# Altium schematic sheet Sht5-V12P0_Jetson.SchDoc
size E; SheetNumber: 4; SheetTotal: 5
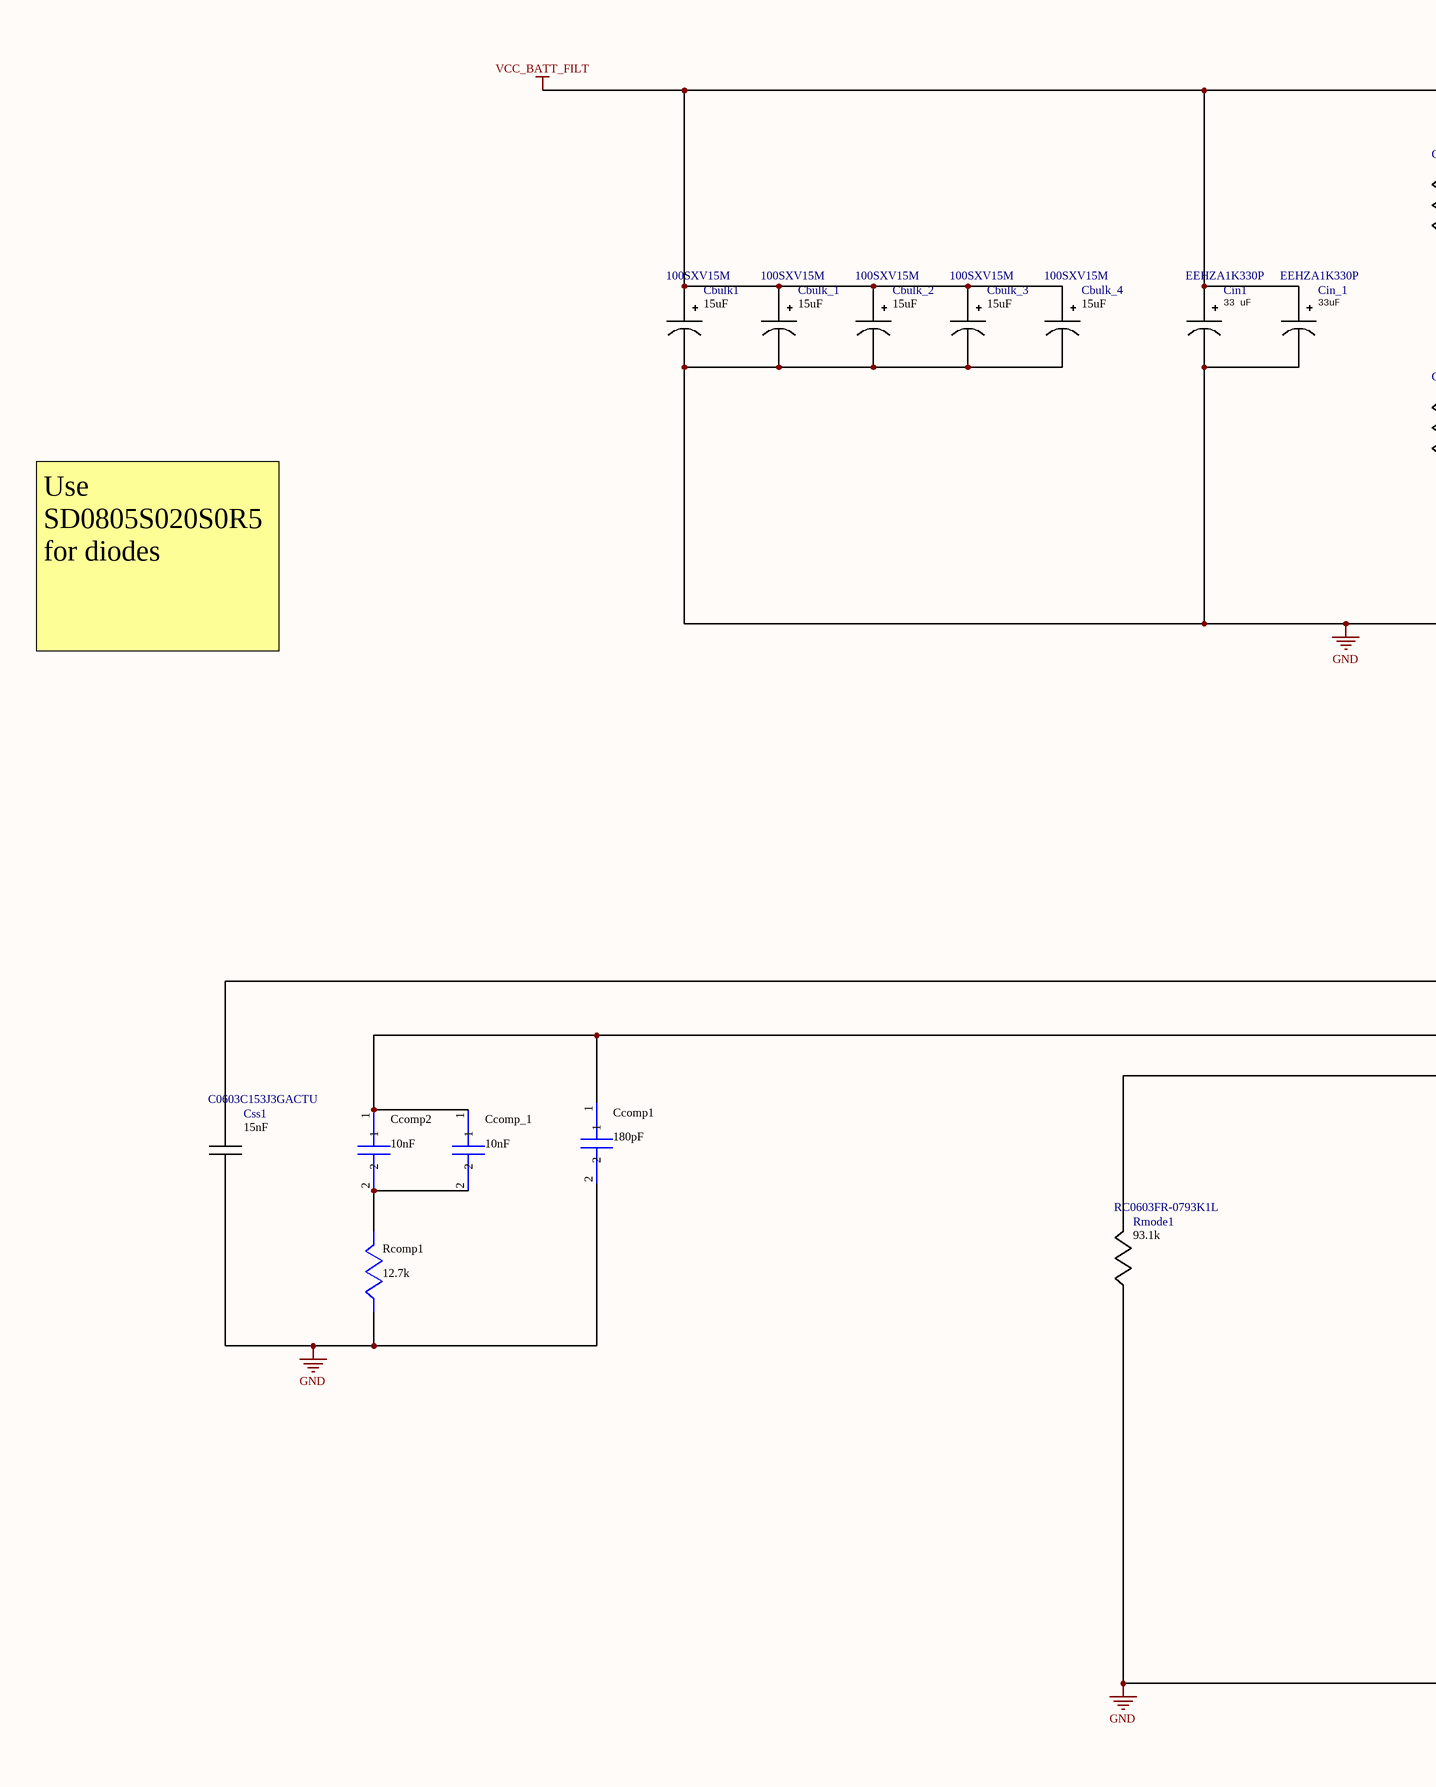
[diagram p0: Sht5-V12P0_Jetson.SchDoc, left]
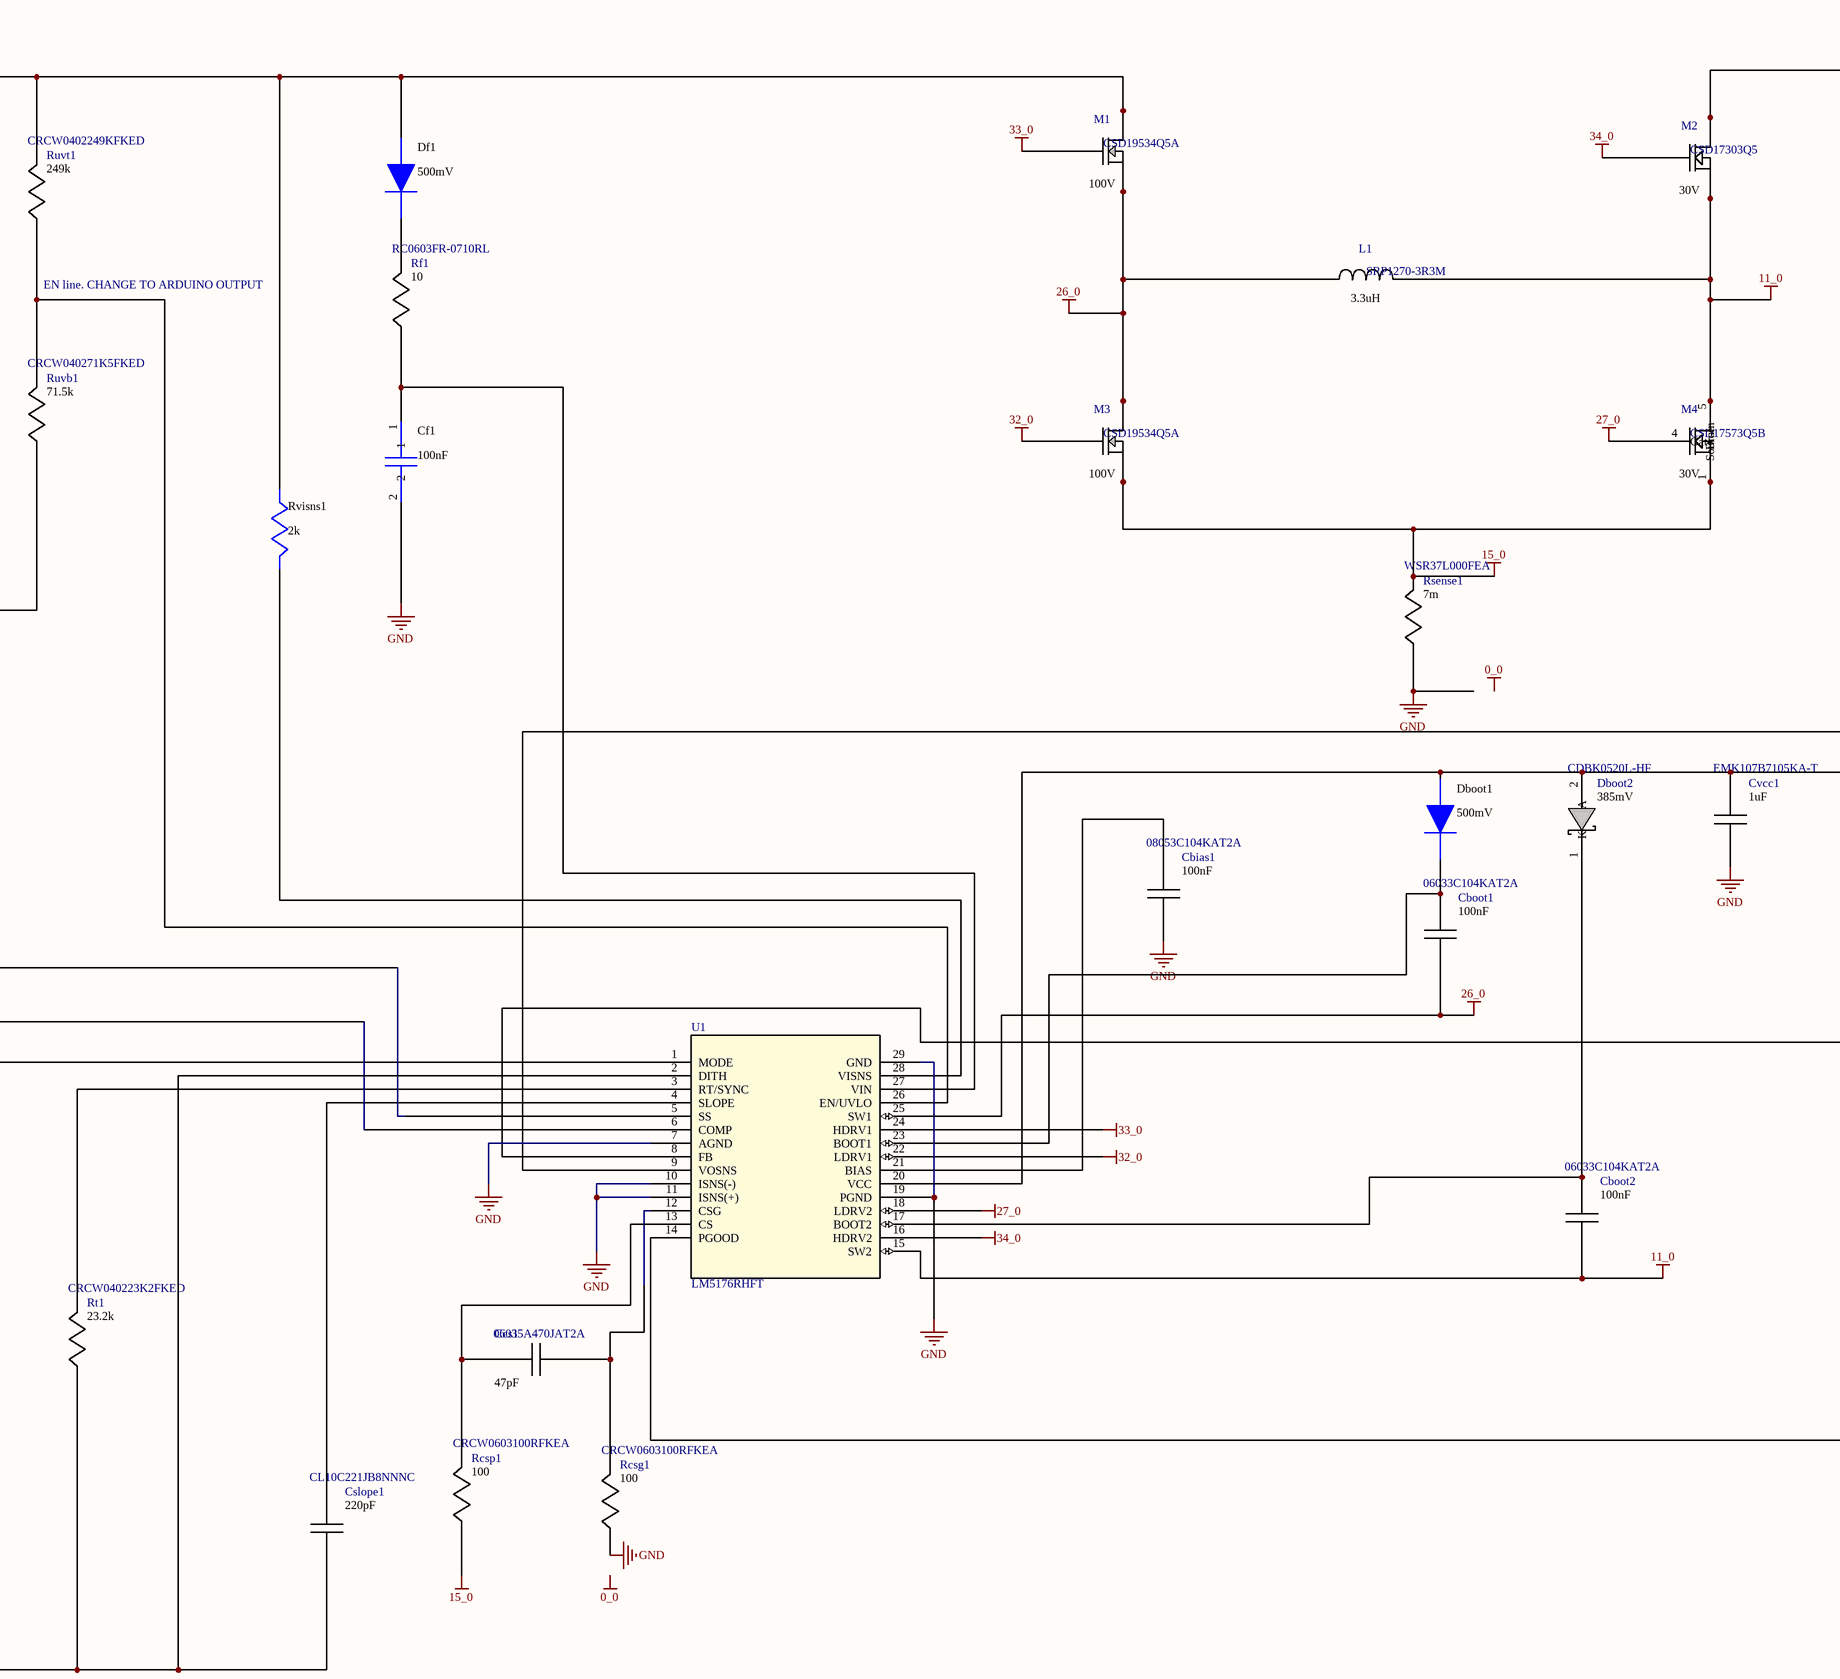
[diagram p1: Sht5-V12P0_Jetson.SchDoc, middle]
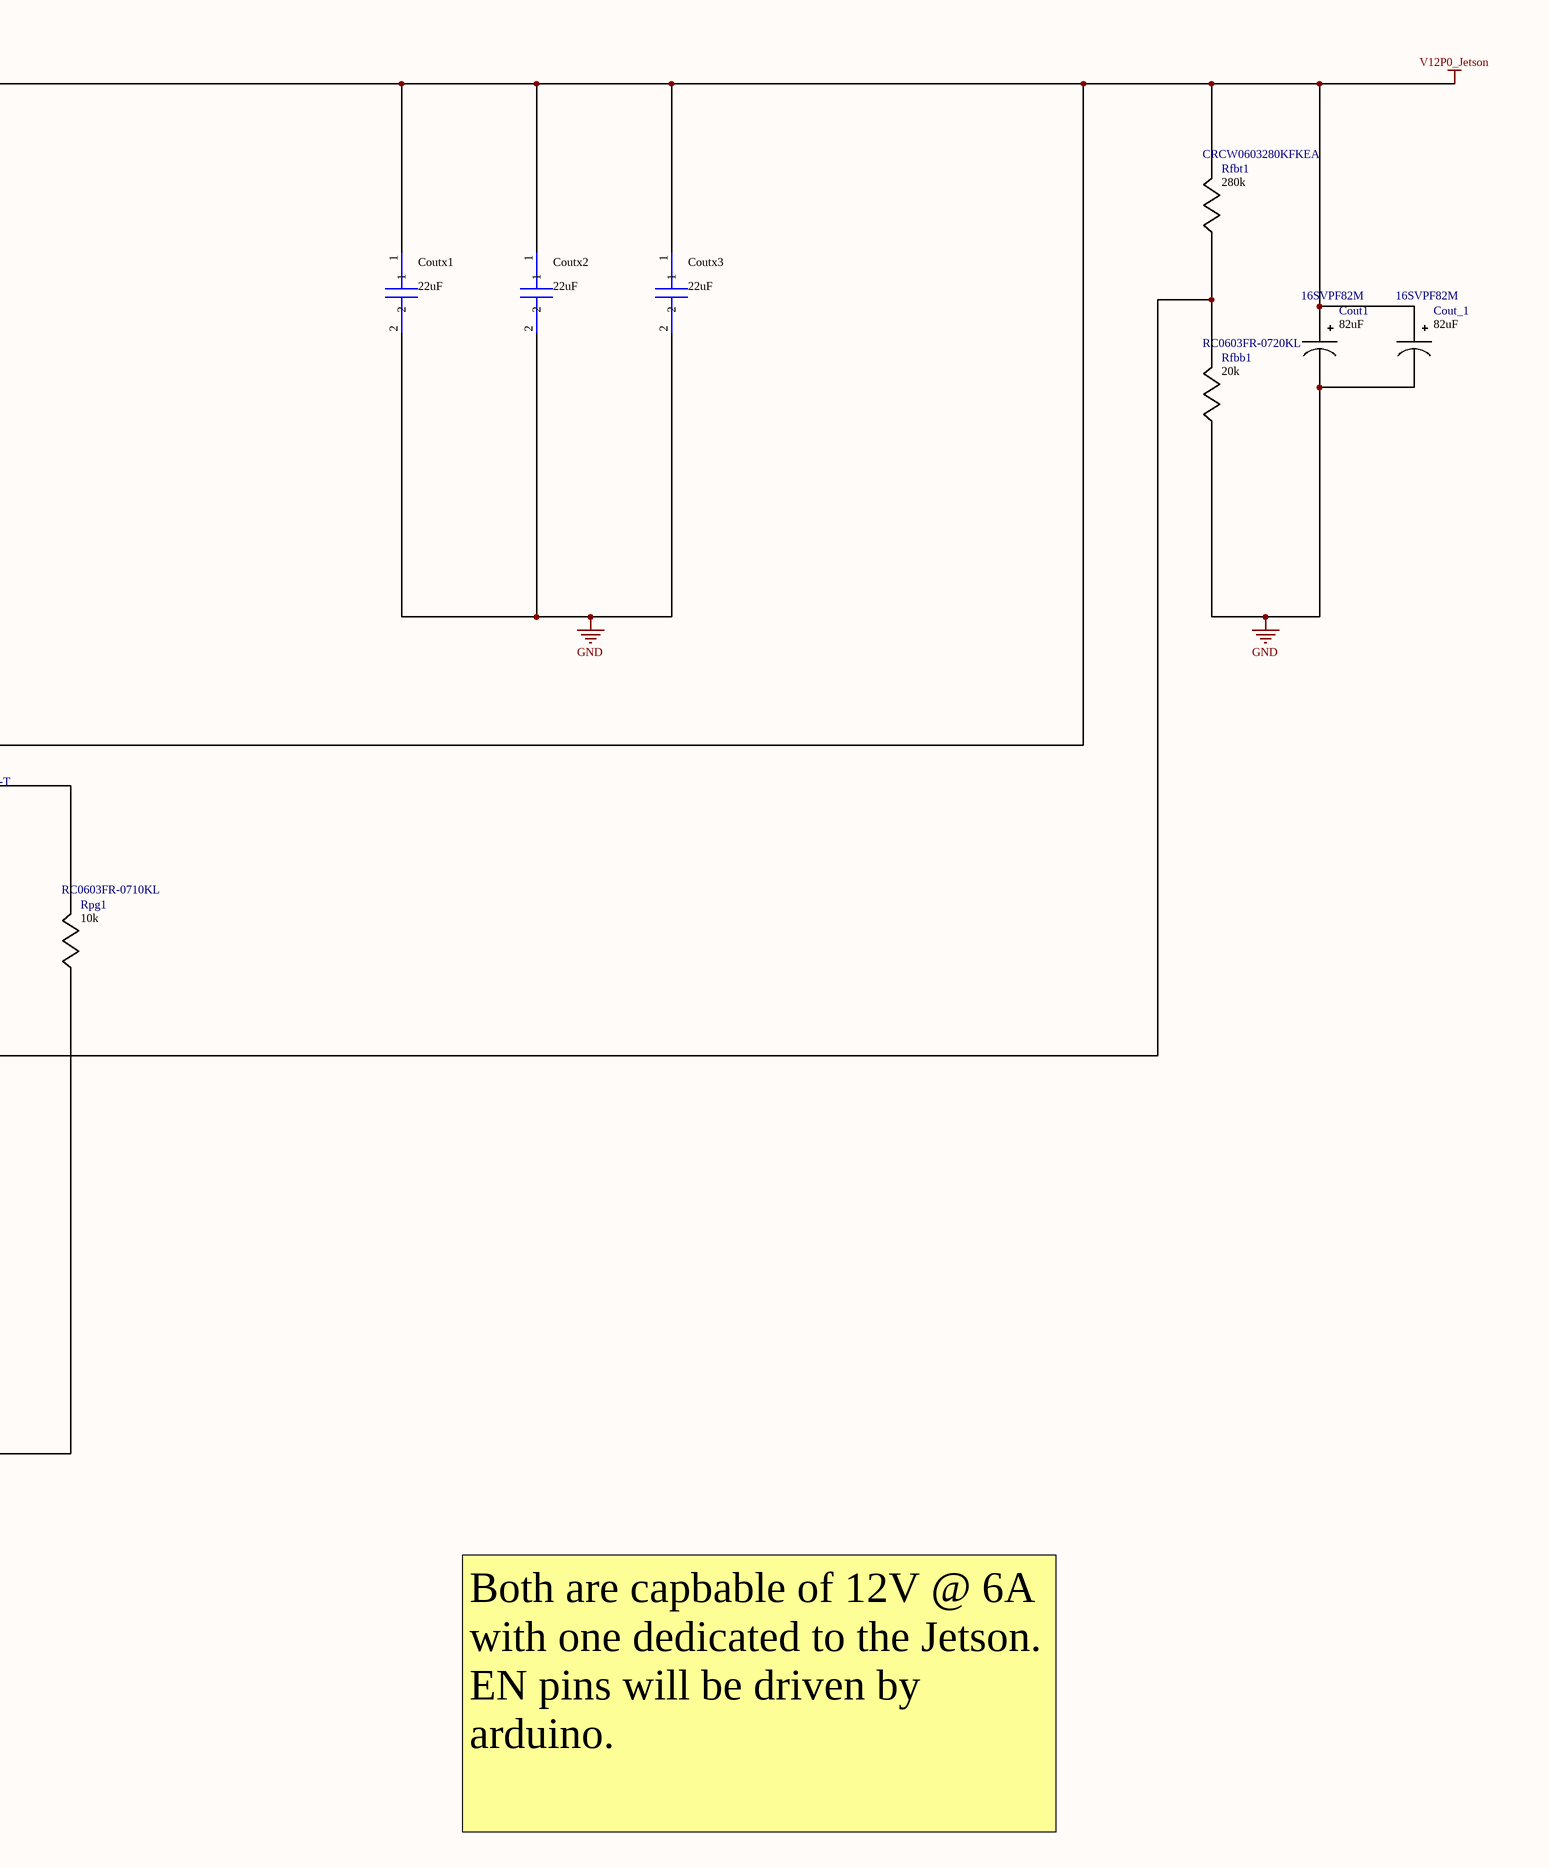
[diagram p2: Sht5-V12P0_Jetson.SchDoc, right]

## Parts
Cbias1  08053C104KAT2A  value 100nF  [0805]
Cboot1  06033C104KAT2A  value 100nF  [0603]
Cboot2  06033C104KAT2A  value 100nF  [0603]
Cbulk1  100SXV15M  value 15uF  [CAPSMT_62_E12]
Cbulk_1  100SXV15M  value 15uF  [CAPSMT_62_E12]
Cbulk_2  100SXV15M  value 15uF  [CAPSMT_62_E12]
Cbulk_3  100SXV15M  value 15uF  [CAPSMT_62_E12]
Cbulk_4  100SXV15M  value 15uF  [CAPSMT_62_E12]
Ccomp1  value 180pF  [0805]  (hidden comment: C0805C181K5GACTU)
Ccomp2  value 10nF  [0402]  (hidden comment: CGA2B3X7R1H103K050BB)
Ccomp_1  value 10nF  [0402]  (hidden comment: CGA2B3X7R1H103K050BB)
Ccs1  06035A470JAT2A  value 47pF  [0603]
Cf1  value 100nF  [0603]  (hidden comment: CGA3E2X7R1H104K080AA)
Cin1  EEHZA1K330P  value 33 uF  [SM_RADIAL_10BMM]
Cin_1  EEHZA1K330P  value 33uF  [SM_RADIAL_10BMM]
Cout1  16SVPF82M  value 82uF  [CAPSMT_62_E61]
Cout_1  16SVPF82M  value 82uF  [CAPSMT_62_E61]
Coutx1  value 22uF  [0805]  (hidden comment: C2012X5R1V226M125AC)
Coutx2  value 22uF  [0805]  (hidden comment: C2012X5R1V226M125AC)
Coutx3  value 22uF  [0805]  (hidden comment: C2012X5R1V226M125AC)
Cslope1  CL10C221JB8NNNC  value 220pF  [0603]
Css1  C0603C153J3GACTU  value 15nF  [0603]
Cvcc1  EMK107B7105KA-T  value 1uF  [0603]
Dboot1  value 500mV  [GEN_Diode]  (hidden comment: GENERIC_DIODE)
Dboot2  CDBK0520L-HF  value 385mV  [SOD-123F]
Df1  value 500mV  [GEN_Diode]  (hidden comment: GENERIC_DIODE)
L1  SRP1270-3R3M  value 3.3uH  [SRP1270]
M1  CSD19534Q5A  value 100V  [TRANS_NexFET_Q5A]
M2  CSD17303Q5  value 30V  [TRANS_NexFET_Q5]
M3  CSD19534Q5A  value 100V  [TRANS_NexFET_Q5A]
M4  CSD17573Q5B  value 30V  [DNK0008A]
Rcomp1  value 12.7k  [0402]  (hidden comment: CRCW040212K7FKED)
Rcsg1  CRCW0603100RFKEA  value 100  [0603]
Rcsp1  CRCW0603100RFKEA  value 100  [0603]
Rf1  RC0603FR-0710RL  value 10  [0603]
Rfbb1  RC0603FR-0720KL  value 20k  [0603]
Rfbt1  CRCW0603280KFKEA  value 280k  [0603]
Rmode1  RC0603FR-0793K1L  value 93.1k  [0603]
Rpg1  RC0603FR-0710KL  value 10k  [0603]
Rsense1  WSR37L000FEA  value 7m  [4527]
Rt1  CRCW040223K2FKED  value 23.2k  [0402]
Ruvb1  CRCW040271K5FKED  value 71.5k  [0402]
Ruvt1  CRCW0402249KFKED  value 249k  [0402]
Rvisns1  value 2k  [0603]  (hidden comment: CRCW06032K00FKEA)
U1  LM5176RHFT  [VQFN_76RHFT_TEX]

## Nets
11_0: Cboot2.2 L1.2 M2.1(Source) M2.2(Source) M2.3(Source) M4.5(Drain) M4.6(Drain) M4.7(Drain) M4.8(Drain) M4.9(Drain) U1.15(SW2)
15_0: M3.1(Source) M3.2(Source) M3.3(Source) M4.1(Source) M4.2(Source) M4.3(Source) Rcsp1.2 Rsense1.1
26_0: Cboot1.2 L1.1 M1.1(Source) M1.2(Source) M1.3(Source) M3.5(Drain) M3.6(Drain) M3.7(Drain) M3.8(Drain) M3.9(Drain) U1.25(SW1)
27_0: M4.4(Gate) U1.18(LDRV2)
32_0: M3.4(Gate) U1.22(LDRV1)
33_0: M1.4(Gate) U1.24(HDRV1)
34_0: M2.4(Gate) U1.16(HDRV2)
GND: Cbias1.2 Cbulk1.2(-) Cbulk_1.2(-) Cbulk_2.2(-) Cbulk_3.2(-) Cbulk_4.2(-) Ccomp1.2 Cf1.2 Cin1.2(-) Cin_1.2(-) Cout1.2(-) Cout_1.2(-) Coutx1.2 Coutx2.2 Coutx3.2 Cslope1.2 Css1.2 Cvcc1.2 Rcomp1.2 Rcsg1.2 Rfbb1.2 Rmode1.2 Rsense1.2 Rt1.2 Ruvb1.2 U1.2(DITH) U1.7(AGND) U1.10(ISNS(-)) U1.11(ISNS(+)) U1.19(PGND) U1.29(GND)
V12P0_Jetson: Cout1.1(+) Cout_1.1(+) Coutx1.1 Coutx2.1 Coutx3.1 M2.5(Drain) M2.6(Drain) M2.7(Drain) M2.8(Drain) M2.9(Drain) Rfbt1.1 U1.9(VOSNS)
VCC_BATT_FILT: Cbulk1.1(+) Cbulk_1.1(+) Cbulk_2.1(+) Cbulk_3.1(+) Cbulk_4.1(+) Cin1.1(+) Cin_1.1(+) Df1.2(A) M1.5(Drain) M1.6(Drain) M1.7(Drain) M1.8(Drain) M1.9(Drain) Ruvt1.1 Rvisns1.2
NetCbias1_1: Cbias1.1 U1.21(BIAS)
NetCboot1_1: Cboot1.1 Dboot1.1(K) U1.23(BOOT1)
NetCboot2_1: Cboot2.1 Dboot2.1(K) U1.17(BOOT2)
NetCcomp1_1: Ccomp1.1 Ccomp2.1 Ccomp_1.1 U1.6(COMP)
NetCcomp2_2: Ccomp2.2 Ccomp_1.2 Rcomp1.1
NetCcs1_1: Ccs1.1 Rcsp1.1 U1.13(CS)
NetCcs1_2: Ccs1.2 Rcsg1.1 U1.12(CSG)
NetCf1_1: Cf1.1 Rf1.2 U1.27(VIN)
NetCslope1_1: Cslope1.1 U1.4(SLOPE)
NetCss1_1: Css1.1 U1.5(SS)
NetCvcc1_1: Cvcc1.1 Dboot1.2(A) Dboot2.2(A) Rpg1.1 U1.20(VCC)
NetDf1_1: Df1.1(K) Rf1.1
NetRfbb1_1: Rfbb1.1 Rfbt1.2 U1.8(FB)
NetRmode1_1: Rmode1.1 U1.1(MODE)
NetRpg1_2: Rpg1.2 U1.14(PGOOD)
NetRt1_1: Rt1.1 U1.3(RT/SYNC)
NetRuvb1_1: Ruvb1.1 Ruvt1.2 U1.26(EN/UVLO)
NetRvisns1_1: Rvisns1.1 U1.28(VISNS)

## Notes on the sheet
- EN line. CHANGE TO ARDUINO OUTPUT
- Use SD0805S020S0R5 for diodes
- Both are capbable of 12V @ 6A with one dedicated to the Jetson. EN pins will be driven by arduino.
- Labels drawn without touching a wire or pin: 0_0

## Library data of the parts
Cbias1 = 08053C104KAT2A: Manufacturer Name: AVX; PackageReference: 08053C104KAT2A; Manufacturer Part Number: 08053C104KAT2A
Cboot1 Cboot2 = 06033C104KAT2A: Manufacturer Name: AVX; PackageReference: 06033C104KAT2A; Manufacturer Part Number: 06033C104KAT2A
Cbulk1 Cbulk_1-Cbulk_4 = 100SXV15M: Manufacturer Name: Panasonic; PackageReference: 100SXV15M; Manufacturer Part Number: 100SXV15M
Ccomp1 = C0805C181K5GACTU: Manufacturer Name: Kemet; PackageReference: C0805C181K5GACTU; Manufacturer Part Number: C0805C181K5GACTU
Ccomp2 Ccomp_1 = CGA2B3X7R1H103K050BB: CGA2B3X7R1H103K0; Manufacturer Name: TDK; PackageReference: CGA2B3X7R1H103K050BB; Manufacturer Part Number: CGA2B3X7R1H103K050BB
Ccs1 = 06035A470JAT2A: Manufacturer Name: AVX; PackageReference: 06035A470JAT2A; Manufacturer Part Number: 06035A470JAT2A
Cf1 = CGA3E2X7R1H104K080AA: CGA3E2X7R1H104K0; Manufacturer Name: TDK; PackageReference: CGA3E2X7R1H104K080AA; Manufacturer Part Number: CGA3E2X7R1H104K080AA
Cin1 Cin_1 = EEHZA1K330P: No Description Available; Cap: 3.3E-5; ESR: 0.036; IRMS: 1.7; VDC: 80.0; Vendor: Panasonic; Datasheet_URL: http://industrial.panasonic.com/www%2Ddata/pdf/ABA0000/ABA0000CE136.pdf; Manufacturer_Part_Number: EEHZA1K330P; Manufacturer_Name: Panasonic; Copyright: Copyright (C) 2018 Accelerated Designs. All rights reserved; RefDes: RefDes; Type: DEV
Cout1 Cout_1 = 16SVPF82M: Manufacturer Name: Panasonic; PackageReference: 16SVPF82M; Manufacturer Part Number: 16SVPF82M
Coutx1-Coutx3 = C2012X5R1V226M125AC: C2012X5R1V226M12; Manufacturer Name: TDK; PackageReference: C2012X5R1V226M125AC; Manufacturer Part Number: C2012X5R1V226M125AC
Cslope1 = CL10C221JB8NNNC: Manufacturer Name: Samsung Electro-Mechanics; PackageReference: CL10C221JB8NNNC; Manufacturer Part Number: CL10C221JB8NNNC
Css1 = C0603C153J3GACTU: Manufacturer Name: Kemet; PackageReference: C0603C153J3GACTU; Manufacturer Part Number: C0603C153J3GACTU
Cvcc1 = EMK107B7105KA-T: Manufacturer Name: Taiyo Yuden; PackageReference: EMK107B7105KA-T; Manufacturer Part Number: EMK107B7105KA-T
Dboot1 = GENERIC_DIODE: CUSTOM1; Manufacturer Name: CUSTOM; PackageReference: CUSTOM; Manufacturer Part Number: GENERIC_DIODE
Dboot2 = CDBK0520L-HF: Manufacturer Name: Comchip Technology; PackageReference: CDBK0520L-HF; Manufacturer Part Number: CDBK0520L-HF
Df1 = GENERIC_DIODE: CUSTOM2; Manufacturer Name: CUSTOM; PackageReference: CUSTOM; Manufacturer Part Number: GENERIC_DIODE
L1 = SRP1270-3R3M: Manufacturer Name: Bourns; PackageReference: SRP1270-3R3M; Manufacturer Part Number: SRP1270-3R3M
M1 M3 = CSD19534Q5A: Manufacturer Name: Texas Instruments; PackageReference: CSD19534Q5A; Manufacturer Part Number: CSD19534Q5A
M2 = CSD17303Q5: Manufacturer Name: Texas Instruments; PackageReference: CSD17303Q5; Manufacturer Part Number: CSD17303Q5
M4 = CSD17573Q5B: CSD17573Q5B- Note out of stock, double check available subs; Manufacturer Name: Texas Instruments; PackageReference: CSD17573Q5B; Manufacturer Part Number: CSD17573Q5B
Rcomp1 = CRCW040212K7FKED: Manufacturer Name: Vishay-Dale; PackageReference: CRCW040212K7FKED; Manufacturer Part Number: CRCW040212K7FKED
Rcsg1 Rcsp1 = CRCW0603100RFKEA: Manufacturer Name: Vishay-Dale; PackageReference: CRCW0603100RFKEA; Manufacturer Part Number: CRCW0603100RFKEA
Rf1 = RC0603FR-0710RL: Manufacturer Name: Yageo; PackageReference: RC0603FR-0710RL; Manufacturer Part Number: RC0603FR-0710RL
Rfbb1 = RC0603FR-0720KL: Manufacturer Name: Yageo; PackageReference: RC0603FR-0720KL; Manufacturer Part Number: RC0603FR-0720KL
Rfbt1 = CRCW0603280KFKEA: Manufacturer Name: Vishay-Dale; PackageReference: CRCW0603280KFKEA; Manufacturer Part Number: CRCW0603280KFKEA
Rmode1 = RC0603FR-0793K1L: Manufacturer Name: Yageo; PackageReference: RC0603FR-0793K1L; Manufacturer Part Number: RC0603FR-0793K1L
Rpg1 = RC0603FR-0710KL: Manufacturer Name: Yageo; PackageReference: RC0603FR-0710KL; Manufacturer Part Number: RC0603FR-0710KL
Rsense1 = WSR37L000FEA: Manufacturer Name: Vishay-Dale; PackageReference: WSR37L000FEA; Manufacturer Part Number: WSR37L000FEA
Rt1 = CRCW040223K2FKED: Manufacturer Name: Vishay-Dale; PackageReference: CRCW040223K2FKED; Manufacturer Part Number: CRCW040223K2FKED
Ruvb1 = CRCW040271K5FKED: Manufacturer Name: Vishay-Dale; PackageReference: CRCW040271K5FKED; Manufacturer Part Number: CRCW040271K5FKED
Ruvt1 = CRCW0402249KFKED: Manufacturer Name: Vishay-Dale; PackageReference: CRCW0402249KFKED; Manufacturer Part Number: CRCW0402249KFKED
Rvisns1 = CRCW06032K00FKEA: Manufacturer Name: Vishay-Dale; PackageReference: CRCW06032K00FKEA; Manufacturer Part Number: CRCW06032K00FKEA
U1 = LM5176RHFT: No Description Available; Mfr_Name: Texas Instruments; Copyright: Copyright (C) 2022 Ultra Librarian. All rights reserved.; Manufacturer_Part_Number: LM5176RHFT; Digi-Key_Part_Number_1: 296-LM5176RHFTTR-ND; Digi-Key_Part_Number_2: 296-LM5176RHFTCT-ND; Digi-Key_Part_Number_3: 296-LM5176RHFTDKR-ND; RefDes: RefDes; Type: DEV